# Altium schematic sheet TOP.SchDoc: =ProjectName
size 420 x 297 mm; Author: G.K.; CompanyName: WUT; DrawnBy: P.K.; Organization: WUT ISE; Address1: Warsaw Univeristy of Technology; Address2: Nowowiejska 15/19; DocumentNumber: 1; Revision: 1.0; SheetNumber: 1; SheetTotal: 12; EDA_Number: ARTIQ; Projet: ARTIQ/SINARA; ModifiedBy: -; CreateDate: XX/XX/XXXX; CheckedDate: -; Title2: TOP.SchDoc; DivGrp: ISE; Designer: G.K. and P.K.; ModifiedDate: -; ProjectName: ARTIQ/SINARA
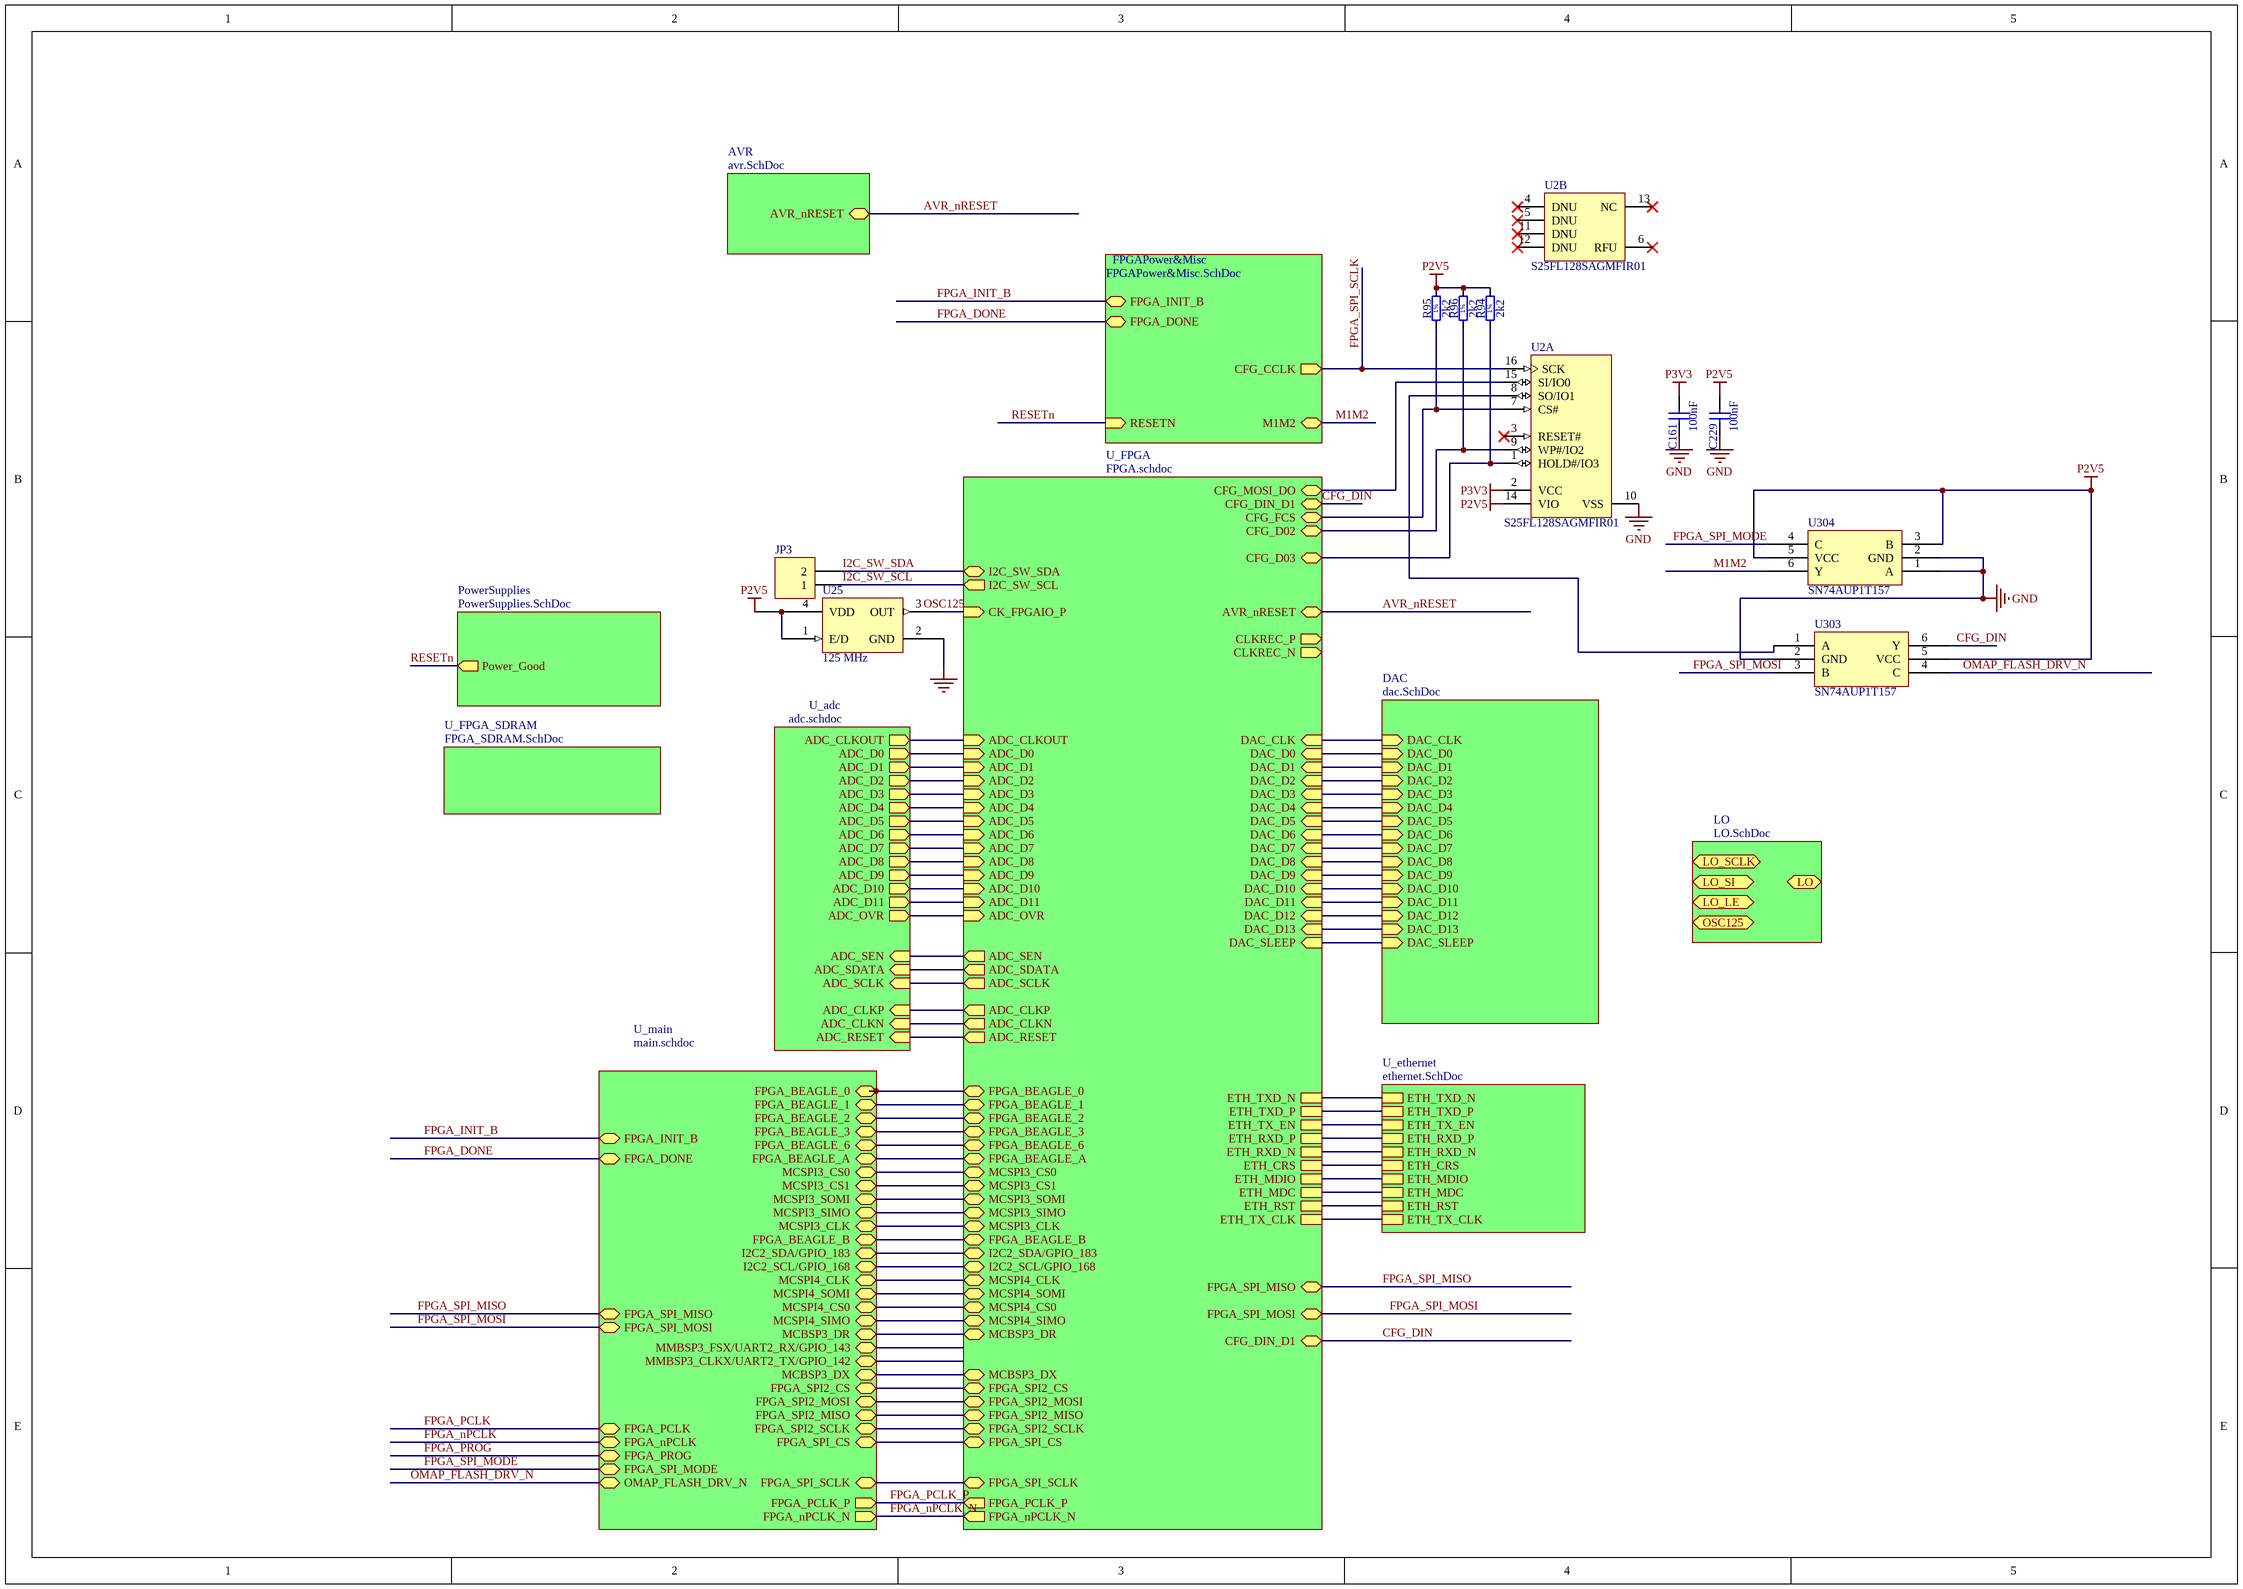
[diagram p0: TOP.SchDoc]

## Parts
C161  100nF  [0603 Polar Cap]
C229  100nF  [0603 Polar Cap]
JP3  (no value)  [HDR1X2]
R94  2k2  [RESC1005X40N]
R95  2k2  [RESC1005X40N]
R96  2k2  [RESC1005X40N]
U2  S25FL128SAGMFIR01  [SOIC127P1030-16L]  (parts A,B of 2)
U25  125 MHz  [CSX750FB]
U303  SN74AUP1T157  [SOT363]
U304  SN74AUP1T157  [SOT363]

## Sub-sheets
AVR = avr.SchDoc: AVR_nRESET (bidir)
DAC = dac.SchDoc: DAC_CLK (in), DAC_D0 (in), DAC_D1 (in), DAC_D2 (in), DAC_D3 (in), DAC_D4 (in), DAC_D5 (in), DAC_D6 (in), DAC_D7 (in), DAC_D8 (in), DAC_D9 (in), DAC_D10 (in), DAC_D11 (in), DAC_D12 (in), DAC_D13 (in), DAC_SLEEP (in)
FPGAPower&Misc = FPGAPower&Misc.SchDoc: RESETN (in), CFG_CCLK (out), FPGA_DONE (bidir), FPGA_INIT_B (bidir), M1M2 (bidir)
LO = LO.SchDoc: no entries
PowerSupplies = PowerSupplies.SchDoc: Power_Good (out)
U_adc = adc.schdoc: ADC_RESET (in), ADC_CLKP (in), ADC_SCLK (in), ADC_SDATA (in), ADC_SEN (in), ADC_CLKOUT (out), ADC_D0 (out), ADC_D1 (out), ADC_D2 (out), ADC_D3 (out), ADC_D4 (out), ADC_D5 (out), ADC_D6 (out), ADC_D7 (out), ADC_D8 (out), ADC_D9 (out), ADC_D10 (out), ADC_D11 (out), ADC_OVR (out), ADC_CLKN (in)
U_ethernet = ethernet.SchDoc: ETH_TXD_N, ETH_TXD_P, ETH_TX_EN, ETH_RXD_P, ETH_RXD_N, ETH_CRS, ETH_MDIO, ETH_MDC, ETH_RST, ETH_TX_CLK
U_FPGA = FPGA.schdoc: FPGA_PCLK_P (out), FPGA_nPCLK_N (out), CK_FPGAIO_P (in), I2C_SW_SDA (bidir), I2C_SW_SCL (out), CFG_MOSI_DO (bidir), CFG_DIN_D1 (bidir), CFG_D02 (bidir), CFG_D03 (bidir), CFG_FCS (bidir), ADC_CLKOUT (in), ADC_D0 (in), ADC_D1 (in), ADC_D2 (in), ADC_D3 (in), ADC_D4 (in), ADC_D5 (in), ADC_D6 (in), ADC_D7 (in), ADC_D8 (in), ADC_D9 (in), ADC_D10 (in), ADC_D11 (in), ADC_OVR (in), ADC_RESET (out), ADC_CLKP (out), ADC_SCLK (out), ADC_SDATA (out), ADC_SEN (out), DAC_CLK (in), DAC_D0 (in), DAC_D1 (in), DAC_D2 (in), DAC_D3 (in), DAC_D4 (in), DAC_D5 (in), DAC_D6 (in), DAC_D7 (in), DAC_D8 (in), DAC_D9 (in), DAC_D10 (in), DAC_D11 (in), DAC_D12 (in), DAC_D13 (in), DAC_SLEEP (in), FPGA_BEAGLE_0 (bidir), FPGA_BEAGLE_1 (bidir), FPGA_BEAGLE_2 (bidir), FPGA_BEAGLE_3 (bidir), FPGA_BEAGLE_6 (bidir), FPGA_BEAGLE_A (bidir), MCSPI3_CS0 (bidir), MCSPI3_CS1 (bidir), MCSPI3_SOMI (bidir), MCSPI3_SIMO (bidir), MCSPI3_CLK (bidir), FPGA_BEAGLE_B (bidir), I2C2_SDA/GPIO_183 (bidir), I2C2_SCL/GPIO_168 (bidir), MCSPI4_CLK (bidir), MCSPI4_SOMI (bidir), MCSPI4_CS0 (bidir), MCSPI4_SIMO (bidir), MCBSP3_DR (bidir), MCBSP3_DX (bidir), FPGA_SPI2_CS (bidir), FPGA_SPI2_MOSI (bidir), FPGA_SPI2_MISO (bidir), FPGA_SPI2_SCLK (bidir), FPGA_SPI_CS (bidir), FPGA_SPI_MOSI (bidir), FPGA_SPI_MISO (bidir), FPGA_SPI_SCLK (bidir), ETH_TXD_N, ETH_TXD_P, ETH_TX_EN, ETH_RXD_P, ETH_RXD_N, ETH_CRS, ETH_MDIO, ETH_MDC, ETH_RST, ETH_TX_CLK, CFG_DIN_D1 (bidir), CLKREC_P (out), CLKREC_N (out), AVR_nRESET (bidir), ADC_CLKN (out)
U_FPGA_SDRAM = FPGA_SDRAM.SchDoc: no entries
U_main = main.schdoc: FPGA_INIT_B (bidir), FPGA_DONE (bidir), FPGA_BEAGLE_0 (bidir), FPGA_BEAGLE_1 (bidir), FPGA_BEAGLE_2 (bidir), FPGA_BEAGLE_3 (bidir), FPGA_BEAGLE_6 (bidir), FPGA_BEAGLE_A (bidir), MCSPI3_CS0 (bidir), MCSPI3_CS1 (bidir), MCSPI3_SOMI (bidir), MCSPI3_SIMO (bidir), MCSPI3_CLK (bidir), FPGA_BEAGLE_B (bidir), I2C2_SDA/GPIO_183 (bidir), I2C2_SCL/GPIO_168 (bidir), MCSPI4_CLK (bidir), MCSPI4_SOMI (bidir), MCSPI4_CS0 (bidir), MCSPI4_SIMO (bidir), MCBSP3_DR (bidir), MMBSP3_FSX/UART2_RX/GPIO_143 (bidir), MMBSP3_CLKX/UART2_TX/GPIO_142 (bidir), MCBSP3_DX (bidir), FPGA_SPI2_CS (bidir), FPGA_SPI2_MOSI (bidir), FPGA_SPI2_MISO (bidir), FPGA_SPI2_SCLK (bidir), FPGA_SPI_CS (bidir), FPGA_SPI_MOSI (bidir), FPGA_SPI_SCLK (bidir), FPGA_PCLK (bidir), FPGA_nPCLK (bidir), FPGA_PROG (bidir), FPGA_SPI_MODE (bidir), OMAP_FLASH_DRV_N (bidir), FPGA_PCLK_P (out), FPGA_nPCLK_N (out), FPGA_SPI_MISO (bidir)

## Ports
LO (out), LO_LE, LO_SCLK (in), LO_SI, OSC125 (in)

## Nets
GND: C161.1 C229.1 U2.10(VSS) U25.2(GND) U303.2(GND) U304.1(A) U304.2(GND)
P2V5: C229.2 R94.2 R95.2 R96.2 U2.14(VIO) U25.1(E/D) U25.4(VDD) U303.5(VCC) U304.3(B) U304.5(VCC)
P3V3: C161.2 U2.2(VCC)
AVR_nRESET: sheet U_FPGA/AVR_nRESET, sheet AVR/AVR_nRESET
CFG_DIN: U303.6(Y) ; sheet U_FPGA/CFG_DIN_D1, sheet U_FPGA/CFG_DIN_D1
FPGA_DONE: sheet FPGAPower&Misc/FPGA_DONE, sheet U_main/FPGA_DONE
FPGA_INIT_B: sheet FPGAPower&Misc/FPGA_INIT_B, sheet U_main/FPGA_INIT_B
FPGA_nPCLK: sheet U_main/FPGA_nPCLK
FPGA_nPCLK_N: sheet U_FPGA/FPGA_nPCLK_N, sheet U_main/FPGA_nPCLK_N
FPGA_PCLK: sheet U_main/FPGA_PCLK
FPGA_PCLK_P: sheet U_FPGA/FPGA_PCLK_P, sheet U_main/FPGA_PCLK_P
FPGA_PROG: sheet U_main/FPGA_PROG
FPGA_SPI_MISO: sheet U_FPGA/FPGA_SPI_MISO, sheet U_main/FPGA_SPI_MISO
FPGA_SPI_MODE: U304.4(C) ; sheet U_main/FPGA_SPI_MODE
FPGA_SPI_MOSI: U303.3(B) ; sheet U_FPGA/FPGA_SPI_MOSI, sheet U_main/FPGA_SPI_MOSI
FPGA_SPI_SCLK: U2.16(SCK) ; sheet FPGAPower&Misc/CFG_CCLK
I2C_SW_SCL: JP3.1 ; sheet U_FPGA/I2C_SW_SCL
I2C_SW_SDA: JP3.2 ; sheet U_FPGA/I2C_SW_SDA
M1M2: U304.6(Y) ; sheet FPGAPower&Misc/M1M2
OMAP_FLASH_DRV_N: U303.4(C) ; sheet U_main/OMAP_FLASH_DRV_N
RESETn: sheet PowerSupplies/Power_Good, sheet FPGAPower&Misc/RESETN
NetR94_1: R94.1 U2.1(HOLD#/IO3) ; sheet U_FPGA/CFG_D03
NetR95_1: R95.1 U2.7(CS#) ; sheet U_FPGA/CFG_FCS
NetR96_1: R96.1 U2.9(WP#/IO2) ; sheet U_FPGA/CFG_D02
NetU2_8: U2.8(SO/IO1) U303.1(A)
NetU2_15: U2.15(SI/IO0) ; sheet U_FPGA/CFG_MOSI_DO
NetU25_3: U25.3(OUT) ; sheet U_FPGA/CK_FPGAIO_P
(unnamed): sheet U_FPGA/ADC_CLKOUT, sheet U_adc/ADC_CLKOUT
(unnamed): sheet U_FPGA/ADC_D0, sheet U_adc/ADC_D0
(unnamed): sheet U_FPGA/ADC_D1, sheet U_adc/ADC_D1
(unnamed): sheet U_FPGA/ADC_D2, sheet U_adc/ADC_D2
(unnamed): sheet U_FPGA/ADC_D3, sheet U_adc/ADC_D3
(unnamed): sheet U_FPGA/ADC_D4, sheet U_adc/ADC_D4
(unnamed): sheet U_FPGA/ADC_D5, sheet U_adc/ADC_D5
(unnamed): sheet U_FPGA/ADC_D6, sheet U_adc/ADC_D6
(unnamed): sheet U_FPGA/ADC_D7, sheet U_adc/ADC_D7
(unnamed): sheet U_FPGA/ADC_D8, sheet U_adc/ADC_D8
(unnamed): sheet U_FPGA/ADC_D9, sheet U_adc/ADC_D9
(unnamed): sheet U_FPGA/ADC_D10, sheet U_adc/ADC_D10
(unnamed): sheet U_FPGA/ADC_D11, sheet U_adc/ADC_D11
(unnamed): sheet U_FPGA/ADC_OVR, sheet U_adc/ADC_OVR
(unnamed): sheet U_FPGA/ADC_RESET, sheet U_adc/ADC_RESET
(unnamed): sheet U_FPGA/ADC_CLKP, sheet U_adc/ADC_CLKP
(unnamed): sheet U_FPGA/ADC_SCLK, sheet U_adc/ADC_SCLK
(unnamed): sheet U_FPGA/ADC_SDATA, sheet U_adc/ADC_SDATA
(unnamed): sheet U_FPGA/ADC_SEN, sheet U_adc/ADC_SEN
(unnamed): sheet U_FPGA/DAC_CLK, sheet DAC/DAC_CLK
(unnamed): sheet U_FPGA/DAC_D0, sheet DAC/DAC_D0
(unnamed): sheet U_FPGA/DAC_D1, sheet DAC/DAC_D1
(unnamed): sheet U_FPGA/DAC_D2, sheet DAC/DAC_D2
(unnamed): sheet U_FPGA/DAC_D3, sheet DAC/DAC_D3
(unnamed): sheet U_FPGA/DAC_D4, sheet DAC/DAC_D4
(unnamed): sheet U_FPGA/DAC_D5, sheet DAC/DAC_D5
(unnamed): sheet U_FPGA/DAC_D6, sheet DAC/DAC_D6
(unnamed): sheet U_FPGA/DAC_D7, sheet DAC/DAC_D7
(unnamed): sheet U_FPGA/DAC_D8, sheet DAC/DAC_D8
(unnamed): sheet U_FPGA/DAC_D9, sheet DAC/DAC_D9
(unnamed): sheet U_FPGA/DAC_D10, sheet DAC/DAC_D10
(unnamed): sheet U_FPGA/DAC_D11, sheet DAC/DAC_D11
(unnamed): sheet U_FPGA/DAC_D12, sheet DAC/DAC_D12
(unnamed): sheet U_FPGA/DAC_D13, sheet DAC/DAC_D13
(unnamed): sheet U_FPGA/DAC_SLEEP, sheet DAC/DAC_SLEEP
(unnamed): sheet U_FPGA/FPGA_BEAGLE_0, sheet U_main/FPGA_BEAGLE_0
(unnamed): sheet U_FPGA/FPGA_BEAGLE_1, sheet U_main/FPGA_BEAGLE_1
(unnamed): sheet U_FPGA/FPGA_BEAGLE_2, sheet U_main/FPGA_BEAGLE_2
(unnamed): sheet U_FPGA/FPGA_BEAGLE_3, sheet U_main/FPGA_BEAGLE_3
(unnamed): sheet U_FPGA/FPGA_BEAGLE_6, sheet U_main/FPGA_BEAGLE_6
(unnamed): sheet U_FPGA/FPGA_BEAGLE_A, sheet U_main/FPGA_BEAGLE_A
(unnamed): sheet U_FPGA/MCSPI3_CS0, sheet U_main/MCSPI3_CS0
(unnamed): sheet U_FPGA/MCSPI3_CS1, sheet U_main/MCSPI3_CS1
(unnamed): sheet U_FPGA/MCSPI3_SOMI, sheet U_main/MCSPI3_SOMI
(unnamed): sheet U_FPGA/MCSPI3_SIMO, sheet U_main/MCSPI3_SIMO
(unnamed): sheet U_FPGA/MCSPI3_CLK, sheet U_main/MCSPI3_CLK
(unnamed): sheet U_FPGA/FPGA_BEAGLE_B, sheet U_main/FPGA_BEAGLE_B
(unnamed): sheet U_FPGA/I2C2_SDA/GPIO_183, sheet U_main/I2C2_SDA/GPIO_183
(unnamed): sheet U_FPGA/I2C2_SCL/GPIO_168, sheet U_main/I2C2_SCL/GPIO_168
(unnamed): sheet U_FPGA/MCSPI4_CLK, sheet U_main/MCSPI4_CLK
(unnamed): sheet U_FPGA/MCSPI4_SOMI, sheet U_main/MCSPI4_SOMI
(unnamed): sheet U_FPGA/MCSPI4_CS0, sheet U_main/MCSPI4_CS0
(unnamed): sheet U_FPGA/MCSPI4_SIMO, sheet U_main/MCSPI4_SIMO
(unnamed): sheet U_FPGA/MCBSP3_DR, sheet U_main/MCBSP3_DR
(unnamed): sheet U_FPGA/MCBSP3_DX, sheet U_main/MCBSP3_DX
(unnamed): sheet U_FPGA/FPGA_SPI2_CS, sheet U_main/FPGA_SPI2_CS
(unnamed): sheet U_FPGA/FPGA_SPI2_MOSI, sheet U_main/FPGA_SPI2_MOSI
(unnamed): sheet U_FPGA/FPGA_SPI2_MISO, sheet U_main/FPGA_SPI2_MISO
(unnamed): sheet U_FPGA/FPGA_SPI2_SCLK, sheet U_main/FPGA_SPI2_SCLK
(unnamed): sheet U_FPGA/FPGA_SPI_CS, sheet U_main/FPGA_SPI_CS
(unnamed): sheet U_FPGA/FPGA_SPI_SCLK, sheet U_main/FPGA_SPI_SCLK
(unnamed): sheet U_FPGA/ETH_TXD_N, sheet U_ethernet/ETH_TXD_N
(unnamed): sheet U_FPGA/ETH_TXD_P, sheet U_ethernet/ETH_TXD_P
(unnamed): sheet U_FPGA/ETH_TX_EN, sheet U_ethernet/ETH_TX_EN
(unnamed): sheet U_FPGA/ETH_RXD_P, sheet U_ethernet/ETH_RXD_P
(unnamed): sheet U_FPGA/ETH_RXD_N, sheet U_ethernet/ETH_RXD_N
(unnamed): sheet U_FPGA/ETH_CRS, sheet U_ethernet/ETH_CRS
(unnamed): sheet U_FPGA/ETH_MDIO, sheet U_ethernet/ETH_MDIO
(unnamed): sheet U_FPGA/ETH_MDC, sheet U_ethernet/ETH_MDC
(unnamed): sheet U_FPGA/ETH_RST, sheet U_ethernet/ETH_RST
(unnamed): sheet U_FPGA/ETH_TX_CLK, sheet U_ethernet/ETH_TX_CLK
(unnamed): sheet U_FPGA/ADC_CLKN, sheet U_adc/ADC_CLKN

Not connected (* = marked no-connect by the designer): U2 3(RESET#)* 4(DNU)* 5(DNU)* 6(RFU)* 11(DNU)* 12(DNU)* 13(NC)*

## Notes on the sheet
- Labels drawn without touching a wire or pin: OSC125
- (in symbol R0402_2K2_1%_0.0625W_100PPM) 1%

## Library data of the parts
C161 C229 = CC0201_100NF_6.3V_10%_X5R: Non-polarised capacitor; Part Description: SMD Multilayer Chip Ceramic Capacitor; Manufacturer: GENERIC; Manufacturer1 Part Number: 02016D104KAT2A; Voltage: 6.3V; TC: X5R; Tolerance: ±10%; Part Number: CC0201_100NF_6.3V_10%_X5R; Component Kind: Standard; Component Type: Standard; Footprint: CAPC0603X33N; Pin Count: 2; Value: 100nF; Status: Not Recommended; Manufacturer Part Number: CC0201_100NF_6.3V_10%_X5R; Case: 0201; Mounted: Yes; Socket: No; SMD: Yes; Sense: No; Manufacturer1 Example: AVX; Manufacturer1 ComponentHeight: 0.33mm; HelpURL: \\cern.ch\dfs\Applications\Altium\Datasheets\CC0201_X5R_AVX.pdf; Author: CERN DEM JLC; CreateDate: 03.12.2007; LatestRevisionDate: 03.12.2007; ClassName: Artix
JP3 = Header 2: Header, 2-Pin; LatestRevisionDate: 17-Jul-2002; LatestRevisionNote: Re-released for DXP Platform.; Publisher: Altium Limited
R94-R96 = R0402_2K2_1%_0.0625W_100PPM: Resistor - 1%; Part Description: General Purpose Thick Film Chip Resistor; Manufacturer: GENERIC; Manufacturer1 Part Number: 232270672202L; TC: ±100ppm/°C; PressFit: No; Part Number: R0402_2K2_1%_0.0625W_100PPM; Component Kind: Standard; Component Type: Standard; Pin Count: 2; Value: 2k2; Status: Not Recommended; Power: 0.0625W; Tolerance: ±1%; Manufacturer Part Number: R0402_2K2_1%_0.0625W_100PPM; Case: 0402; Mounted: Yes; Sense: No; Socket: No; SMD: Yes; Manufacturer1 Example: YAGEO PHYCOMP; Manufacturer1 ComponentHeight: 0.4mm; HelpURL: \\cern.ch\dfs\Applications\Altium\Datasheets\R0402_Phycomp_RC0402.pdf; Author: CERN DEM JLC; CreateDate: 03.12.2007; LatestRevisionDate: 17.10.2012; ClassName: Artix
U2 = CMP-1329-00021-1: MirrorBit Flash Non-Volatile Memory CMOS 3.0 Volt Core with Versatile I/O, Serial Peripheral Interface with Multi-I/O, 128 Mbit, 133 MHz, -40 to 85 degC, 16-Pin SO (SO3016), RoHS, Tube; Manufacturer: Spansion; OTP: 1024 B; VCC: 2.7 to 3.6 V; Speed: 133 MHz; PackageDescription: 16-Pin Wide Plastic Small Outline Package, Body 10.3 x 7.5 mm, Pitch 1.27 mm; ComponentLink2URL: http://www.spansion.com/Support/Datasheets/S25FL128S_256S_00.pdf; PartNumber: S25FL128SAGMFIR01; Packing: Tube; Density: 128 Mbit; Temperature Range: -40 to 85 degC; Mounting Technology: Surface Mount; RoHS: TRUE; DatasheetVersion: Rev. 08; ComponentLink2Description: Datasheet; ComponentLink3URL: http://www.spansion.com/Support/Datasheets/S25FL128S_256S_00.pdf; ComponentLink1Description: Manufacturer URL; ComponentLink1URL: http://www.spansion.com/Pages/Default.aspx; ComponentLink3Description: Package Specification
U25 = CWX815-100.0M: CWX815-125.0M; Part No.: CW585TR-ND; Manufacturer: Citizen America; Distributor: Digikey; Manufacturer Part Number: CWX815-100.0M
U304 = N74AUP1T157